# Altium schematic sheet Peripherals_LCD_Board.SchDoc
size A3; Organization: Altium Limited; Address1: L3, 12a Rodborough Rd; Address2: Frenchs Forest; Address3: NSW; Address4: Australia 2086; SheetNumber: 1; SheetTotal: 1
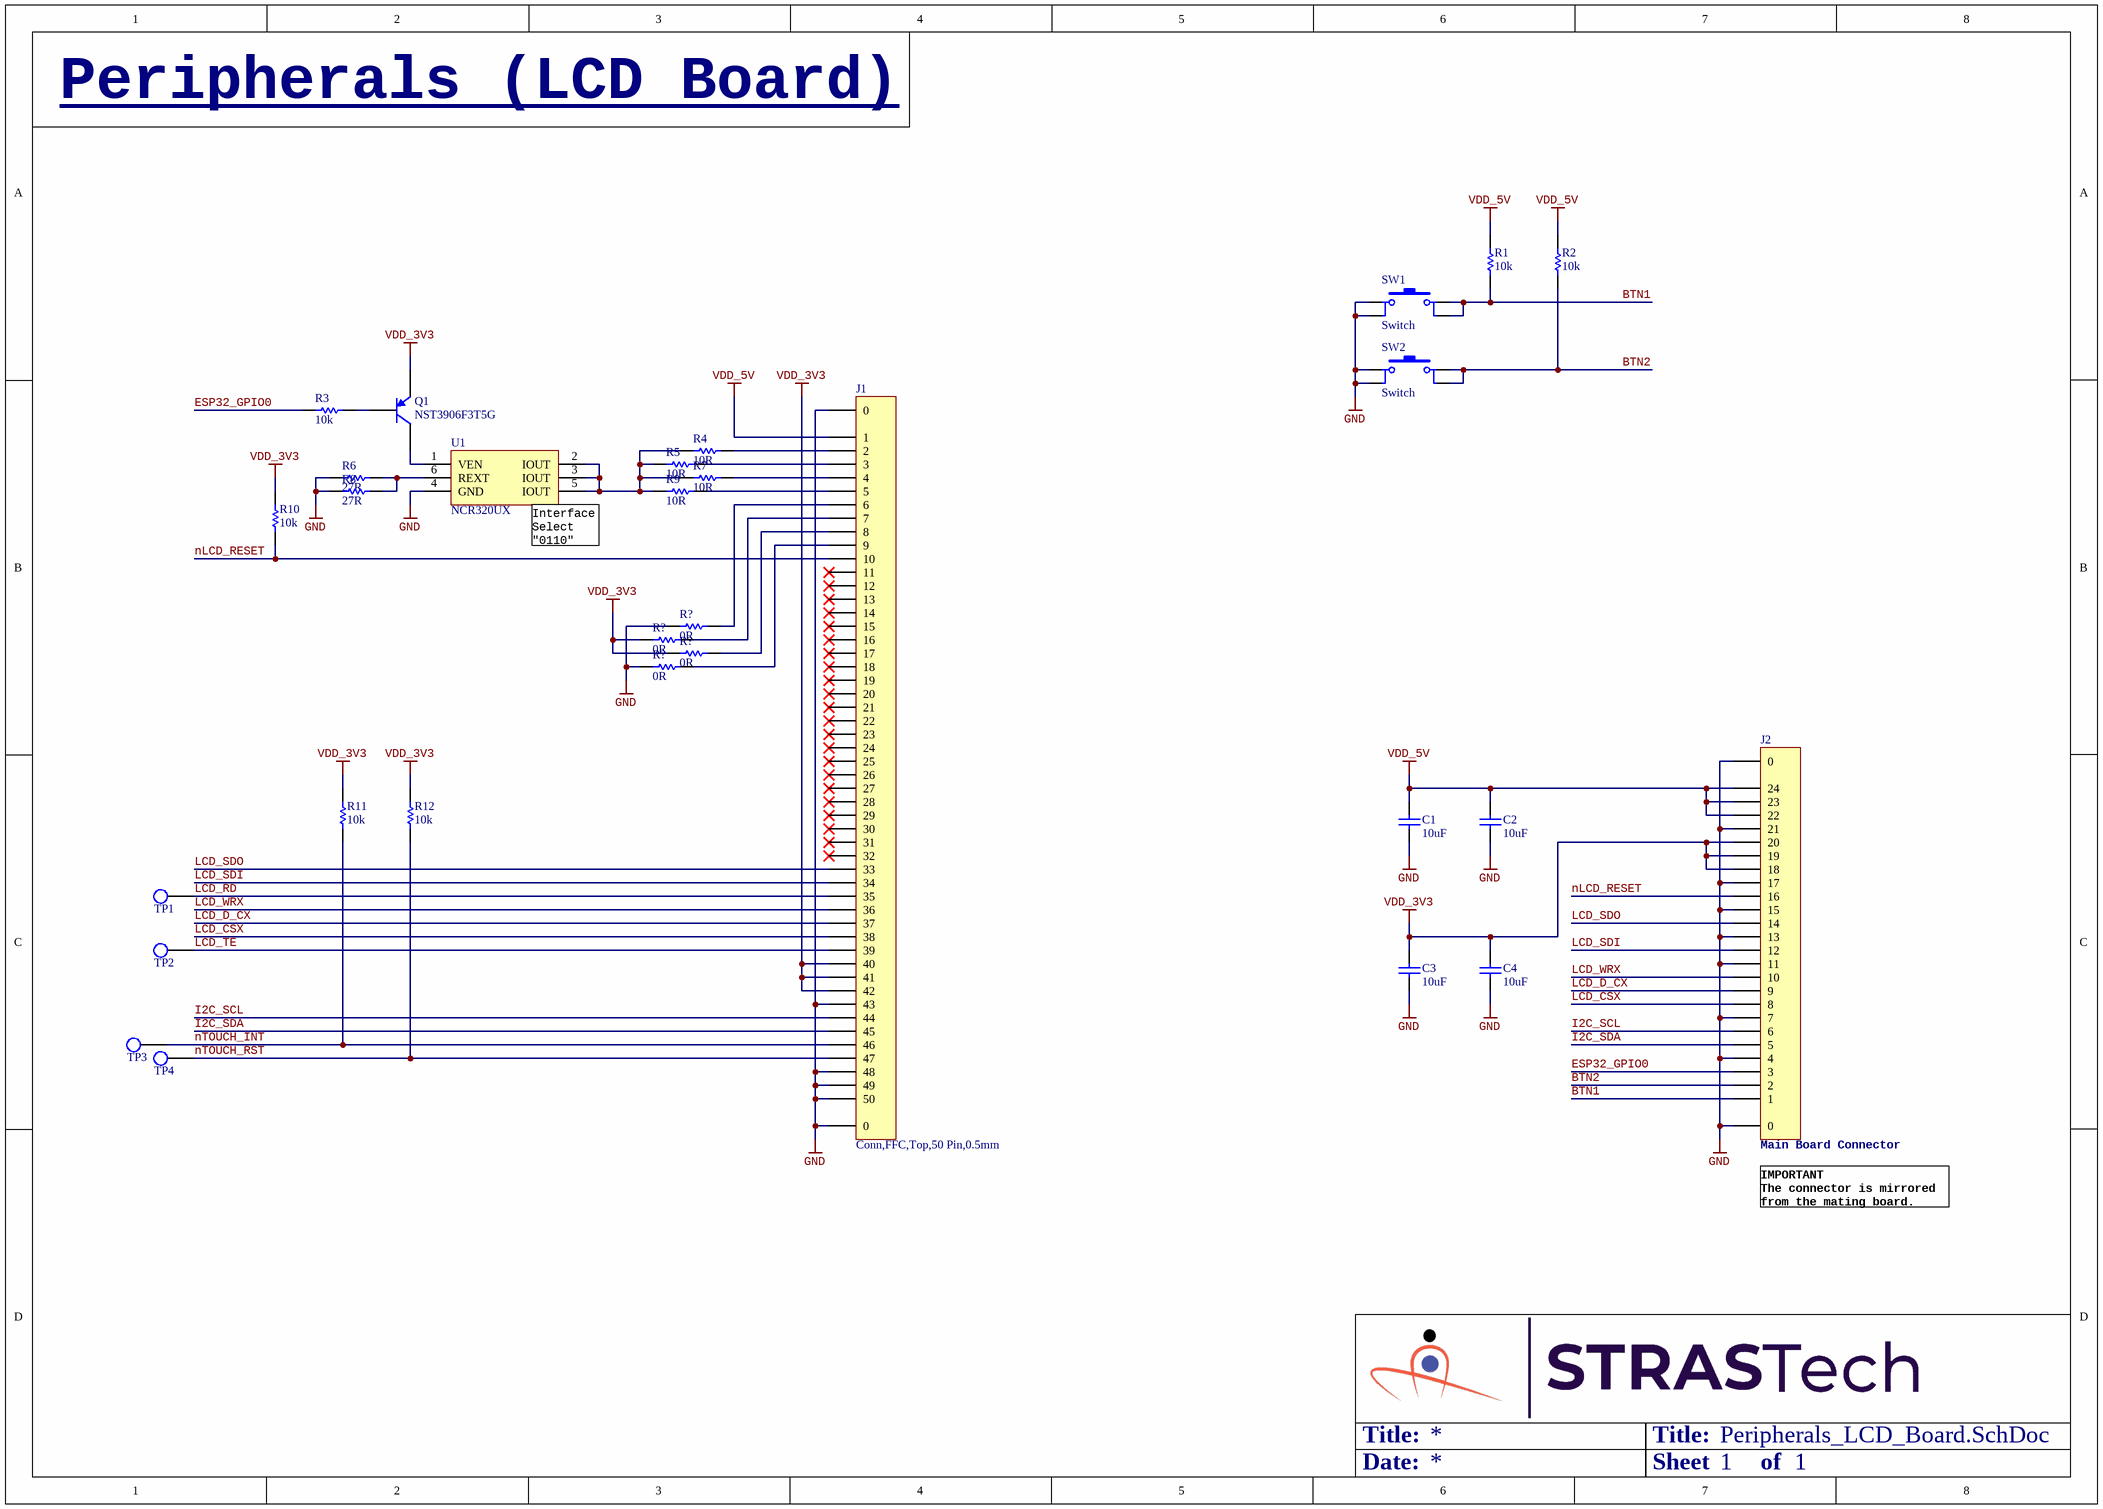
[diagram p0: Peripherals_LCD_Board.SchDoc]

## Parts
(Parts that share a designator on the sheet are numbered #1, #2 ... from top to bottom, then left to right.)
C1  10uF  [Cap,SMD,0402]
C2  10uF  [Cap,SMD,0402]
C3  10uF  [Cap,SMD,0402]
C4  10uF  [Cap,SMD,0402]
J1  Conn,FFC,Top,50 Pin,0.5mm  [Conn,FFC,Top,50Pos,0.5mm]
J2  Conn,FFC,Bottom,24 Pin,0.5mm  [Conn,FFC,Bottom,24Pos,0.5mm]  (value not drawn)
Q1  NST3906F3T5G  [SOT1123]
R1  10k  [RES,0402]
R2  10k  [RES,0402]
R3  10k  [RES,0402]
R4  10R  [RES,0402]
R5  10R  [RES,0402]
R6  27R  [RES,0402]
R7  10R  [RES,0402]
R8  27R  [RES,0402]
R9  10R  [RES,0402]
R10  10k  [RES,0402]
R11  10k  [RES,0402]
R12  10k  [RES,0402]
R?#1  0R  [RES,0402]
R?#2  0R  [RES,0402]
R?#3  0R  [RES,0402]
R?#4  0R  [RES,0402]
SW1  Switch  [Switch,Tactile,SPST-NO,Thru]
SW2  Switch  [Switch,Tactile,SPST-NO,Thru]
TP1  TESTPOINT  [testpoint,smd,round,1mm]  (value not drawn)
TP2  TESTPOINT  [testpoint,smd,round,1mm]  (value not drawn)
TP3  TESTPOINT  [testpoint,smd,round,1mm]  (value not drawn)
TP4  TESTPOINT  [testpoint,smd,round,1mm]  (value not drawn)
U1  NCR320UX  [SOT23-6]

## Nets
GND: C1.1 C2.1 C3.1 C4.1 J1.0 J1.43 J1.48 J1.49 J1.50 J2.0 J2.4 J2.7 J2.11 J2.13 J2.15 J2.17 J2.21 R6.1 R8.1 R?#1.1 R?#4.1 SW1.1 SW1.2 SW2.1 SW2.2 U1.4(GND)
VDD_3V3: C3.2 C4.2 J1.40 J1.41 J1.42 J2.18 J2.19 J2.20 Q1.2(E) R10.2 R11.2 R12.2 R?#2.1 R?#3.1
VDD_5V: C1.2 C2.2 J1.1 J2.22 J2.23 J2.24 R1.2 R2.2
BTN1: J2.1 R1.1 SW1.3 SW1.4
BTN2: J2.2 R2.1 SW2.3 SW2.4
ESP32_GPIO0: J2.3 R3.1
I2C_SCL: J1.44 J2.6
I2C_SDA: J1.45 J2.5
LCD_CSX: J1.38 J2.8
LCD_D_CX: J1.37 J2.9
LCD_RD: J1.35 TP1.1(TP)
LCD_SDI: J1.34 J2.12
LCD_SDO: J1.33 J2.14
LCD_TE: J1.39 TP2.1(TP)
LCD_WRX: J1.36 J2.10
nLCD_RESET: J1.10 J2.16 R10.1
nTOUCH_INT: J1.46 R11.1 TP3.1(TP)
nTOUCH_RST: J1.47 R12.1 TP4.1(TP)
NetJ1_2: J1.2 R4.2
NetJ1_3: J1.3 R5.2
NetJ1_4: J1.4 R7.2
NetJ1_5: J1.5 R9.2
NetJ1_6: J1.6 R?#1.2
NetJ1_7: J1.7 R?#2.2
NetJ1_8: J1.8 R?#3.2
NetJ1_9: J1.9 R?#4.2
NetQ1_1: Q1.1(B) R3.2
NetQ1_3: Q1.3(C) U1.1(VEN)
NetR4_1: R4.1 R5.1 R7.1 R9.1 U1.2(IOUT) U1.3(IOUT) U1.5(IOUT)
NetR6_2: R6.2 R8.2 U1.6(REXT)

Not connected (* = marked no-connect by the designer): J1 11* 12* 13* 14* 15* 16* 17* 18* 19* 20* 21* 22* 23* 24* 25* 26* 27* 28* 29* 30* 31* 32*

## Notes on the sheet
- Peripherals (LCD Board)
- (near U1) Interface Select
  "0110"
- (near J2) Main Board Connector
- (near J2) IMPORTANT
  The connector is mirrored from the mating board.
- Title:
- Date:
- Sheet
- of
- Title
- Size:
- A3
- Revision:
- Design By:

## Library data of the parts
C1-C4 = CAP,Cer,10uF,10VDC,X5R,0402: 10 µF ±20% 10V Ceramic Capacitor X5R 0402 (1005 Metric); Vendor Part Number: 1276-1450-1-ND; Manufacturer: Samsung Electro-Mechanics; Manufacturer Part Number: CL05A106MP5NUNC; Vendor: Digikey; HelpURL: https://media.digikey.com/pdf/Data%20Sheets/Samsung%20PDFs/CL05A106MP5NUNC_Spec.pdf; CreatedBy: Judd Foster
J1 = Conn,FFC,Top,50 Pin,0.5mm: 50 Position FFC, FPC Connector Contacts, Top 0.020" (0.50mm) Surface Mount, Right Angle; Vendor Part Number: 609-F32Q-1A7H1-11050CT-ND; Manufacturer: Amphenol ICC (FCI); Manufacturer Part Number: F32Q-1A7H1-11050; Vendor: Digikey; HelpURL: https://www.amphenol-icc.com/media/wysiwyg/files/documentation/datasheet/flex/ffc_fpc_050mm_f32r_f32q.pdf; Created By: Judd Foster
J2 = Conn,FFC,Bottom,24 Pin,0.5mm: 24 Position FFC, FPC Connector Contacts, Bottom 0.020" (0.50mm) Surface Mount, Right Angle; Vendor Part Number: 2057-PCA-6-LA-24-HL-3-ND; Manufacturer: Adam Tech; Manufacturer Part Number: PCA-6-LA-24-HL-3; Vendor: Digikey; HelpURL: https://app.adam-tech.com/products/download/data_sheet/198704/pca-6-la-xx-hl-3-data-sheet.pdf; Created By: Judd Foster
Q1 = Trans,PNP,40V,200mA,SOT1123: Bipolar (BJT) Transistor PNP 40 V 200 mA 250MHz 290 mW Surface Mount SOT-1123; Manufacturer: ON Semiconductor; Vendor Part Number: NST3906F3T5GOSCT-ND; Vendor: Digikey; CreatedBy: Judd Foster; HelpURL: https://www.onsemi.com/pdf/datasheet/nst3906f3-d.pdf; Manufacturer Part Number: NST3906F3T5G
R1-R3 R10-R12 = RES,10k,5%,0.063W,0402: 10 kOhms ±5% 0.063W, 1/16W Chip Resistor 0402 (1005 Metric) Automotive AEC-Q200 Thick Film; Vendor Part Number: RMCF0402JT10K0CT-ND; Manufacturer: Stackpole Electronics Inc; Manufacturer Part Number: RMCF0402JT10K0; Vendor: DIgikey; HelpURL: https://www.seielect.com/catalog/sei-rmcf_rmcp.pdf; CreatedBy: Judd Foster
R4 R5 R7 R9 = RES,10R,1%,0.063W,0402: 10 Ohms ±1% 0.063W, 1/16W Chip Resistor 0402 (1005 Metric) Automotive AEC-Q200 Thick Film; Manufacturer: Panasonic Electronic Components; Manufacturer Part Number: ERJ-2RKF10R0X; Vendor Part Number: P10.0LCT-ND; Vendor: Digikey; CreatedBy: Judd Foster; HelpURL: https://industrial.panasonic.com/cdbs/www-data/pdf/RDA0000/AOA0000C304.pdf
R6 R8 = RES,27R,5%,0.063W,0402: 27 Ohms ±5% 0.063W, 1/16W Chip Resistor 0402 (1005 Metric) Automotive AEC-Q200 Thick Film; Vendor Part Number: RMCF0402JT27R0CT-ND; Manufacturer: Stackpole Electronics Inc; Manufacturer Part Number: RMCF0402JT27R0; Vendor: DIgikey; HelpURL: https://www.seielect.com/catalog/sei-rmcf_rmcp.pdf; CreatedBy: Judd Foster
R?#1-R?#4 = RES,0R0,0.1W,0402: 0 Ohms Jumper 0.1W, 1/10W Chip Resistor 0402 (1005 Metric) Automotive AEC-Q200 Thick Film; Manufacturer: Panasonic Electronic Components; Manufacturer Part Number: ERJ-2GE0R00X; Vendor Part Number: P0.0JCT-ND; Vendor: Digikey; CreatedBy: Judd Foster; HelpURL: https://industrial.panasonic.com/cdbs/www-data/pdf/RDA0000/AOA0000C301.pdf
SW1 SW2 = Switch,Tactile,SPST-NO,Thru: Tactile Switch SPST-NO Top Actuated Through Hole; Manufacturer: TE Connectivity; Manufacturer Part Number: 1825910-6; Vendor Part Number: 450-1650-ND; Vendor: Digikey; CreatedBy: Judd Foster; HelpURL: https://www.te.com/commerce/DocumentDelivery/DDEController?Action=srchrtrv&DocNm=1825910&DocType=Customer+Drawing&DocLang=English
TP1-TP4 = TESTPOINT: PCB Testpoint; CreatedBy: Judd Foster; HelpURL: N/A; Manufacturer: N/A; Manufacturer Part Number: N/A; Vendor: N/A; Vendor Part Number: N/A
U1 = NCR320UX: LED Driver IC 1 Output Linear Constant Current PWM Dimming 250mA 6-TSOP; Manufacturer: Nexperia USA Inc.; Vendor Part Number: 1727-8458-1-ND; Vendor: Digikey; CreatedBy: Judd Foster; HelpURL: https://assets.nexperia.com/documents/data-sheet/NCR320U_NCR321U.pdf; Manufacturer Part Number: NCR320UX